# Altium schematic sheet dep-switches.SchDoc
size A4
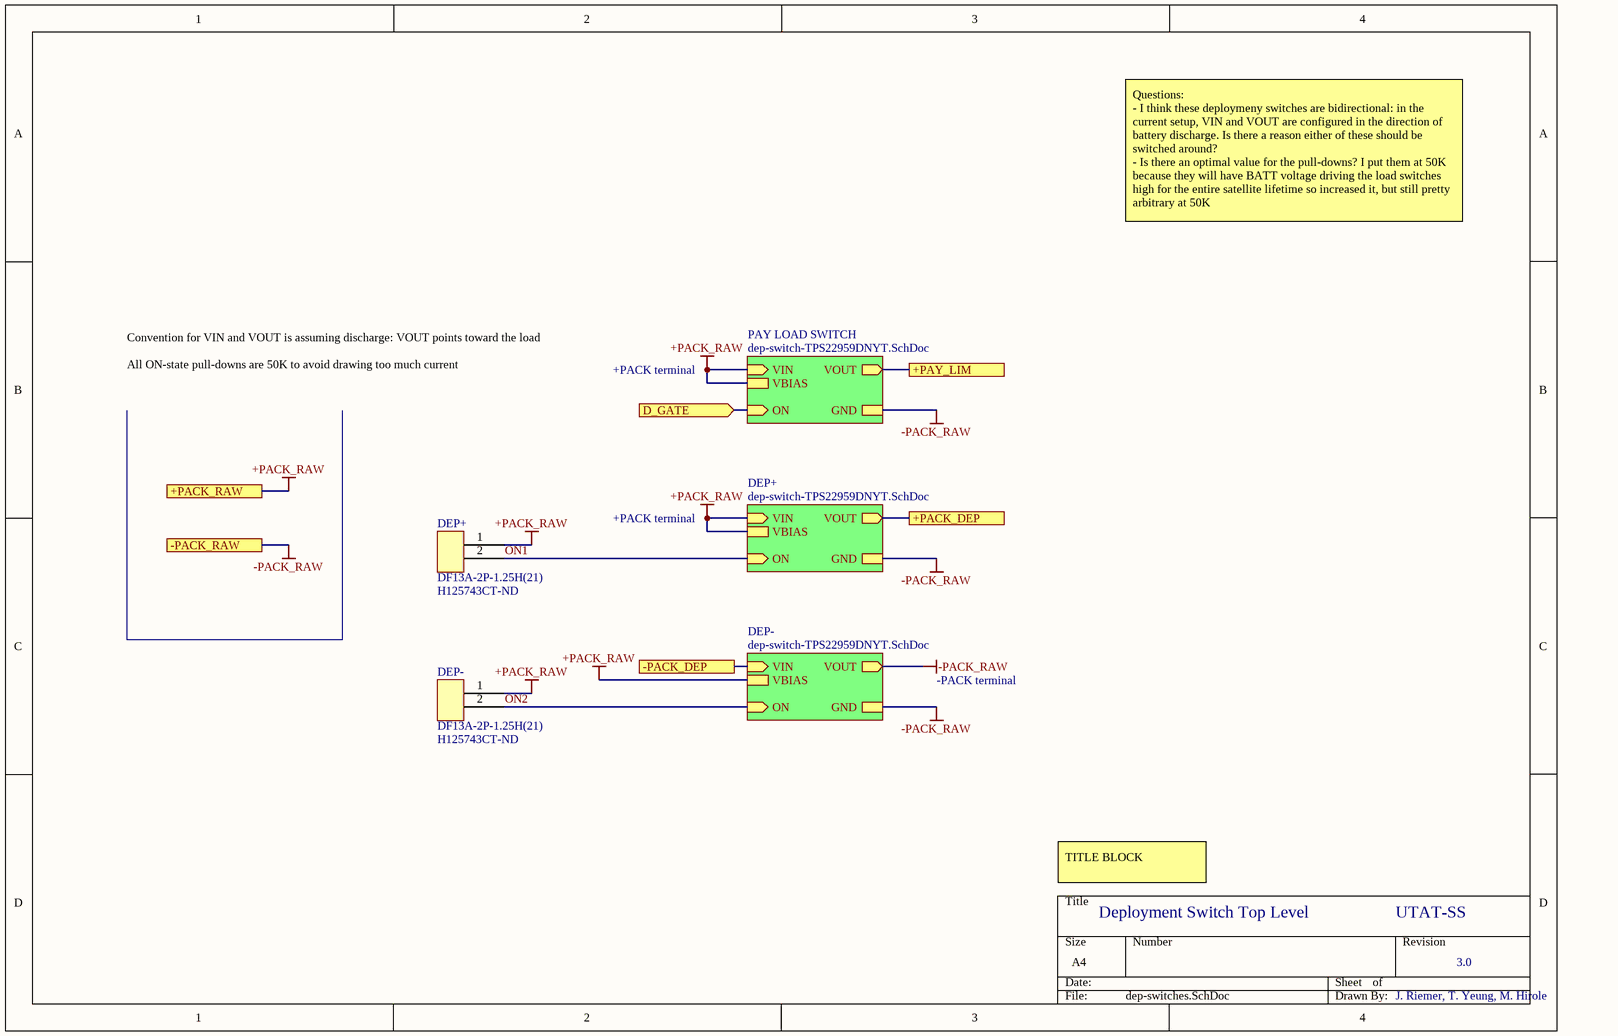
[diagram p0: dep-switches.SchDoc]

## Parts
DEP+  DF13A-2P-1.25H(21)  Supplier Part Number 1: H125743CT-ND  [DF13A-2P-1.25H(21)]
DEP-  DF13A-2P-1.25H(21)  Supplier Part Number 1: H125743CT-ND  [DF13A-2P-1.25H(21)]

## Sub-sheets
DEP+ = dep-switch-TPS22959DNYT.SchDoc: VOUT (out), VIN (in), GND, VBIAS, ON (in)
DEP- = dep-switch-TPS22959DNYT.SchDoc: VOUT (out), VIN (in), GND, VBIAS, ON (in)
PAY LOAD SWITCH = dep-switch-TPS22959DNYT.SchDoc: VOUT (out), VIN (in), GND, VBIAS, ON (in)

## Ports
+PACK_DEP, +PACK_RAW, +PAY_LIM, -PACK_DEP, -PACK_RAW, D_GATE (in)

## Nets
+PACK_RAW: DEP+.1 DEP-.1 ; port +PACK_RAW, sheet DEP+/VIN, sheet DEP+/VBIAS, sheet DEP-/VBIAS, sheet PAY LOAD SWITCH/VIN, sheet PAY LOAD SWITCH/VBIAS
-PACK_RAW: port -PACK_RAW, sheet DEP+/GND, sheet DEP-/VOUT, sheet DEP-/GND, sheet PAY LOAD SWITCH/GND
+PACK_DEP: port +PACK_DEP, sheet DEP+/VOUT
+PAY_LIM: port +PAY_LIM, sheet PAY LOAD SWITCH/VOUT
-PACK_DEP: port -PACK_DEP, sheet DEP-/VIN
D_GATE: port D_GATE, sheet PAY LOAD SWITCH/ON
ON1: DEP+.2 ; sheet DEP+/ON
ON2: DEP-.2 ; sheet DEP-/ON

## Notes on the sheet
- Questions:
  - I think these deploymeny switches are bidirectional: in the current setup, VIN and VOUT are configured in the direction of battery discharge. Is there a reason either of these should be switched around?
  - Is there an optimal value for the pull-downs? I put them at 50K because they will have BATT voltage driving the load switches high for the entire satellite lifetime so increased it, but still pretty arbitrary at 50K
- +PACK terminal
- Convention for VIN and VOUT is assuming discharge: VOUT points toward the load
  All ON-state pull-downs are 50K to avoid drawing too much current
- -PACK terminal
- TITLE BLOCK
- Deployment Switch Top Level
- UTAT-SS
- 3.0
- J. Riemer, T. Yeung, M. Hirole

## Library data of the parts
DEP+ DEP- = DF13A-2P-1.25H(21): 2 pos DF13 right angle surface mount connector; Supplier 1: Digi-Key